# EAGLE design pwm-logger (EAGLE 8.1.1)
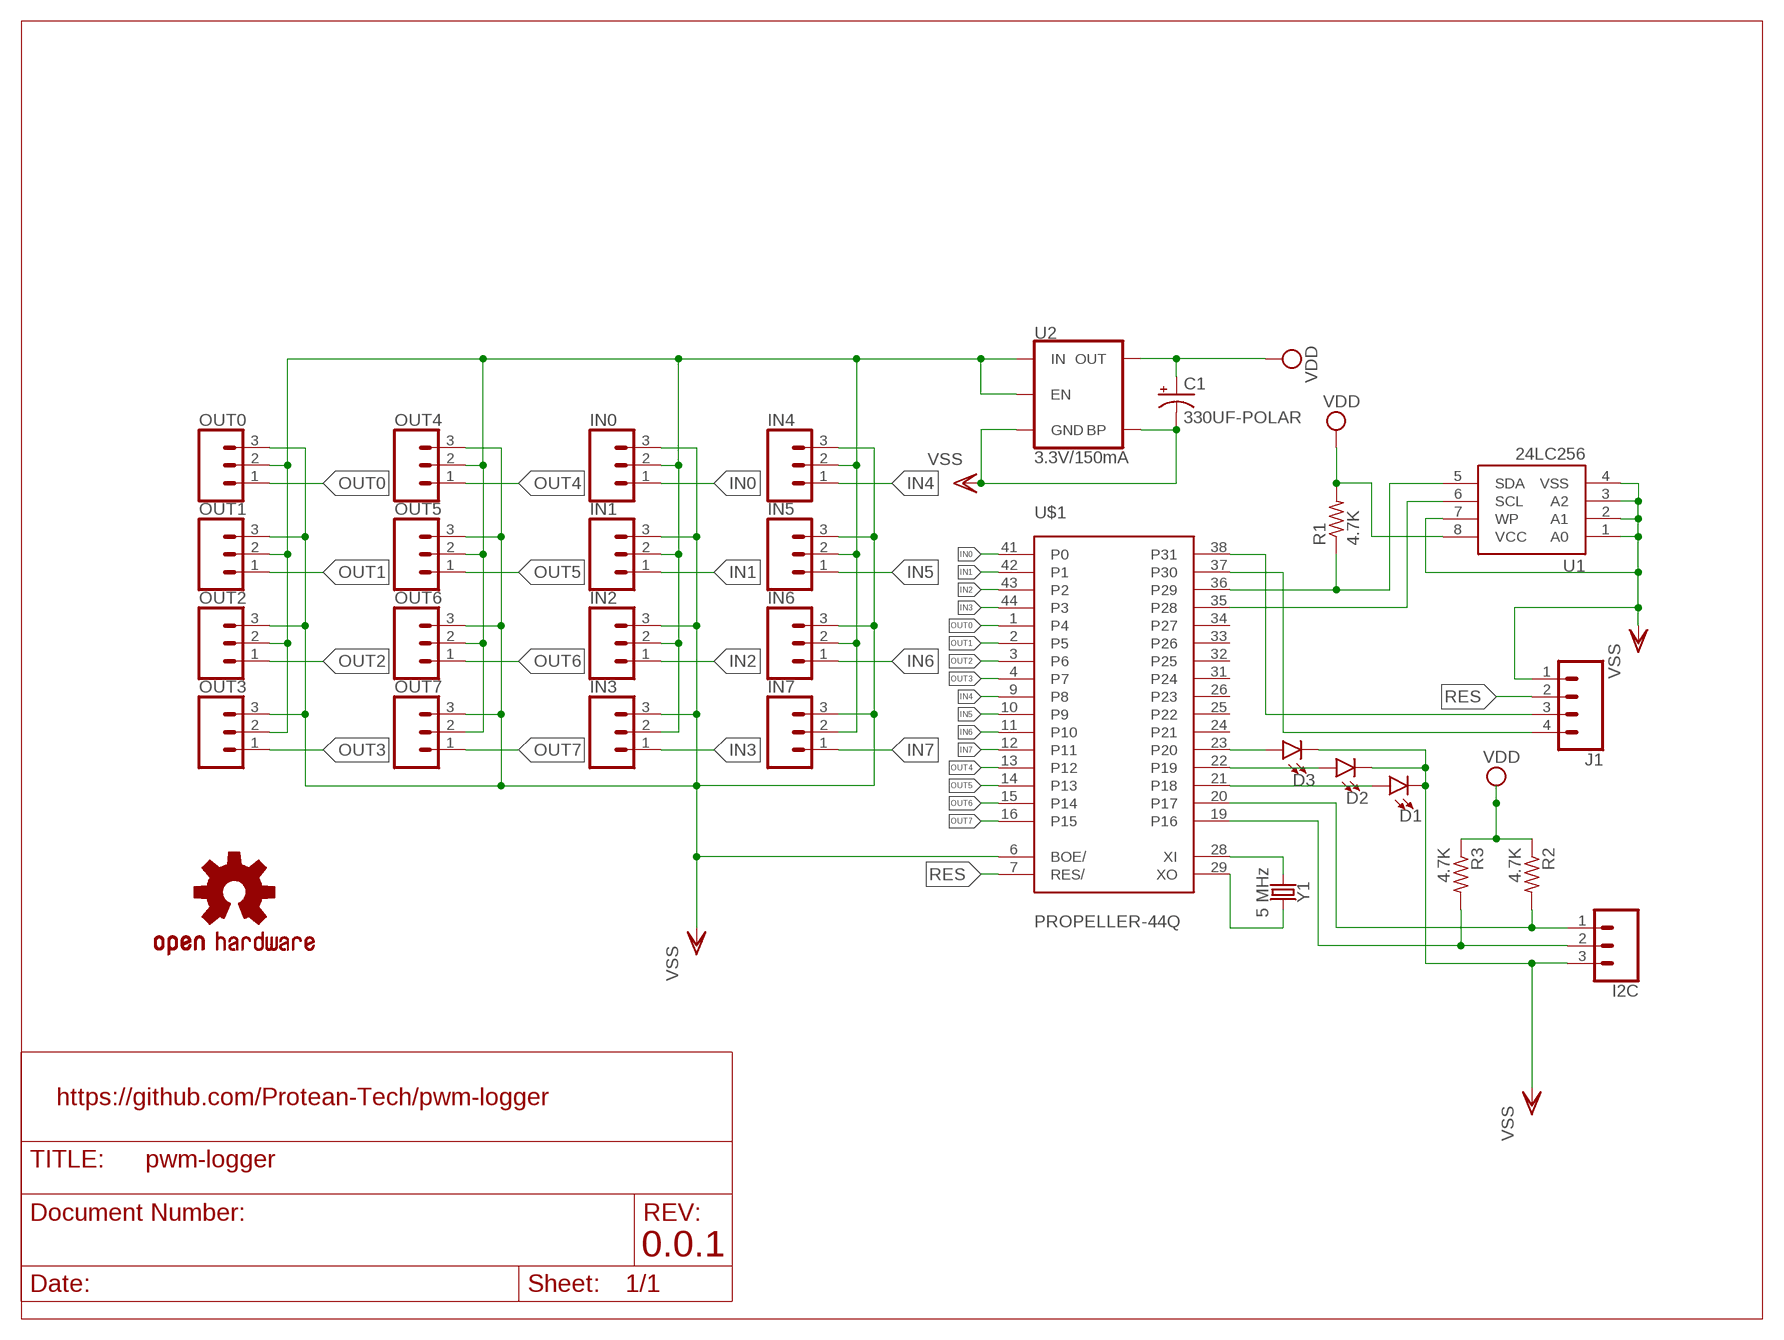
[diagram p0: schematic, sheet 1]

## Parts
C1  330UF-POLAR  [1311]
D1  LED-FKIT-1206  [FKIT-LED-1206]
D2  LED-FKIT-1206  [FKIT-LED-1206]
D3  LED-FKIT-1206  [FKIT-LED-1206]
I2C  CONN_03  [1X03]
IN0  CONN_03  [1X03]
IN1  CONN_03  [1X03]
IN2  CONN_03  [1X03]
IN3  CONN_03  [1X03]
IN4  CONN_03  [1X03]
IN5  CONN_03  [1X03]
IN6  CONN_03  [1X03]
IN7  CONN_03  [1X03]
J1  CONN_04  [1X04]
LOGO1  OSHW-LOGOM  [OSHW-LOGO-M]
OUT0  CONN_03  [1X03]
OUT1  CONN_03  [1X03]
OUT2  CONN_03  [1X03]
OUT3  CONN_03  [1X03]
OUT4  CONN_03  [1X03]
OUT5  CONN_03  [1X03]
OUT6  CONN_03  [1X03]
OUT7  CONN_03  [1X03]
R1  4.7K  R-US_M2012  [M2012]
R2  4.7K  R-US_M2012  [M2012]
R3  4.7K  R-US_M2012  [M2012]
U1  24LC256  EEPROM-I2CSMD  [SO08]
U2  3.3V/150mA  V_REG_MIC52053.3V  [SOT23-5]
U$1  PROPELLER-44Q  [Q44]
Y1  5 MHz  CRYSTALPTH-HC49UV  [HC49U]

## Nets
IN0: IN0.1 U$1.41(P0)
IN1: IN1.1 U$1.42(P1)
IN2: IN2.1 U$1.43(P2)
IN3: IN3.1 U$1.44(P3)
IN4: IN4.1 U$1.9(P8)
IN5: IN5.1 U$1.10(P9)
IN6: IN6.1 U$1.11(P10)
IN7: IN7.1 U$1.12(P11)
N$1: U$1.28(XI) Y1.1
N$2: U$1.29(XO) Y1.2
N$3: D3.A U$1.23(P20)
N$4: D2.A U$1.22(P19)
N$5: J1.3 U$1.38(P31)
N$6: D1.A U$1.21(P18)
N$8: J1.4 U$1.37(P30)
OUT0: OUT0.1 U$1.1(P4)
OUT1: OUT1.1 U$1.2(P5)
OUT2: OUT2.1 U$1.3(P6)
OUT3: OUT3.1 U$1.4(P7)
OUT4: OUT4.1 U$1.13(P12)
OUT5: OUT5.1 U$1.14(P13)
OUT6: OUT6.1 U$1.15(P14)
OUT7: OUT7.1 U$1.16(P15)
POWER_IN: IN0.2 IN1.2 IN2.2 IN3.2 IN4.2 IN5.2 IN6.2 IN7.2 OUT0.2 OUT1.2 OUT2.2 OUT3.2 OUT4.2 OUT5.2 OUT6.2 OUT7.2 U2.1(IN) U2.3(EN)
RES: J1.2 U$1.7(RES/)
SCL: I2C.1 R2.2 U$1.20(P17)
SCL_EEP: U1.6(SCL) U$1.35(P28)
SDA: I2C.2 R3.2 U$1.19(P16)
SDA_EEP: R1.1 U1.5(SDA) U$1.36(P29)
VDD: C1.+ R1.2 R2.1 R3.1 U1.8(VCC) U2.5(OUT)
VSS: C1.- D1.C D2.C D3.C I2C.3 IN0.3 IN1.3 IN2.3 IN3.3 IN4.3 IN5.3 IN6.3 IN7.3 J1.1 OUT0.3 OUT1.3 OUT2.3 OUT3.3 OUT4.3 OUT5.3 OUT6.3 OUT7.3 U1.1(A0) U1.2(A1) U1.3(A2) U1.4(VSS) U1.7(WP) U2.2(GND) U2.4(BP) U$1.6(BOE/)
Unconnected: U$1.24(P21) U$1.25(P22) U$1.26(P23) U$1.31(P24) U$1.32(P25) U$1.33(P26) U$1.34(P27)

## Notes on the sheet
- https://github.com/Protean-Tech/pwm-logger
- 0.0.1

## Power pins joined to a net without a drawn wire
VDD: U$1.8(VDD) U$1.18(VDD) U$1.30(VDD) U$1.40(VDD)
VSS: U$1.5(VSS) U$1.17(VSS) U$1.27(VSS) U$1.39(VSS)

## Library data of the parts
C1 = SparkFun-Capacitors:330UF-POLAR: 330µF polarized capacitors A capacitor is a passive two-terminal electrical component used to store electrical energy temporarily in an electric field.
D1-D3 = SparkFun-LED:LED: LED (Generic) Standard schematic elements and footprints for 5mm, 3mm, 1206, and 0603 sized LEDs. Generic LEDs with no color specified.
I2C IN0 IN1-IN7 OUT0 OUT1-OUT7 = SparkFun-Connectors:CONN_03: Multi connection point. Often used as Generic Header-pin footprint for 0.1 inch spaced/style header connections On any of the 0.1 inch spaced packages, you can populate with these: Break Away Headers - Straight <https://www.sparkfun.com/products/116> (PRT-00116) Break Away Male Headers - Right Angle <https://www.sparkfun.com/products/553> (PRT-00553) Female Headers <https://www.sparkfun.com/products/115> (PRT-00115) Break Away Headers - Machine Pin <https://www.sparkfun.com/products/117> (PRT-00117) Break Away Female Headers - Swiss Machine Pin <https://www.sparkfun.com/products/743> (PRT-00743) Stackable Header - 3 Pin (Female, 0.1") <https://www.sparkfun.com/products/13875> (PRT-13875) For SCREWTERMINALS and SPRING TERMINALS visit here: Screw Terimnals on SparkFun.com <https://www.sparkfun.com/search/results?term=Screw+Terminals> (5mm/3.5mm/2.54mm spacing) This device is also useful as a general connection point to wire up your design to another part of your project. Our various solder wires solder well into these plated through hole pads. Hook-Up Wire - Assortment (Stranded, 22 AWG) <https://www.sparkfun.com/products/11375> (PRT-11375) Hook-Up Wire - Assortment (Solid Core, 22 AWG) <https://www.sparkfun.com/products/11367> (PRT-11367) View the entire wire category on our website here <https://www.sparkfun.com/categories/141> Special notes: Molex polarized connector foot print use with SKU : PRT-08232 with associated crimp pins and housings.
J1 = SparkFun-Connectors:CONN_04: Multi connection point. Often used as Generic Header-pin footprint for 0.1 inch spaced/style header connections On any of the 0.1 inch spaced packages, you can populate with these: Break Away Headers - Straight <https://www.sparkfun.com/products/116> (PRT-00116) Break Away Male Headers - Right Angle <https://www.sparkfun.com/products/553> (PRT-00553) Female Headers <https://www.sparkfun.com/products/115> (PRT-00115) Break Away Headers - Machine Pin <https://www.sparkfun.com/products/117> (PRT-00117) Break Away Female Headers - Swiss Machine Pin <https://www.sparkfun.com/products/743> (PRT-00743) For SCREWTERMINALS and SPRING TERMINALS visit here: Screw Terimnals on SparkFun.com <https://www.sparkfun.com/search/results?term=Screw+Terminals> (5mm/3.5mm/2.54mm spacing) This device is also useful as a general connection point to wire up your design to another part of your project. Our various solder wires solder well into these plated through hole pads. Hook-Up Wire - Assortment (Stranded, 22 AWG) <https://www.sparkfun.com/products/11375> (PRT-11375) Hook-Up Wire - Assortment (Solid Core, 22 AWG) <https://www.sparkfun.com/products/11367> (PRT-11367) View the entire wire category on our website here <https://www.sparkfun.com/categories/141> Special notes: Molex polarized connector foot print use with SKU : PRT-08231 with associated crimp pins and housings. 1MM SMD Version SKU: PRT-10208; PROD_ID: CONN-09696
LOGO1 = SparkFun-Aesthetics:OSHW-LOGO: Open-Source Hardware (OSHW) Logo This logo indicates the piece of hardware it is found on incorporates a OSHW license and/or adheres to the definition of open source hardware found here: http://freedomdefined.org/OSHW
R1-R3 = resistor:R-US_: RESISTOR, American symbol
U1 = SparkFun-IC-Memory:EEPROM-I2C: I2C EEPROMs, 24LC256 and others 24LC256 Series 256 kb I2C 2 Wire (32 k x 8 Bit) 2.5 V Serial EEPROM SMD - SOIC-8 Datasheet SparkFun Products SparkFun UDB5 - PIC UAV Development Board <https://www.sparkfun.com/products/11703> (GPS-11703); PROD_ID: IC-09714
U2 = SparkFun-IC-Power:V_REG_MIC5205: V_REG MIC5205 Standard 3.3V, 5V, and Adjustable 150mA LDO voltage regulator in SOT-23 layout. Micrel part MIC5205. BP (by-pass) pin is used to lower output noise with 470pF cap, may be left open. On the adjustable version BP is used to set output.; PROD_ID: VREG-00822
U$1 = parallax:PROPELLER-44
Y1 = SparkFun-Clocks:CRYSTAL: Crystals (Generic) These are passive quartz crystals, which can be used as a clock source for a microcontroller. Crystal's are two-terminal devices. They require external "load" capacitors to generate an oscillating signal.

## Board
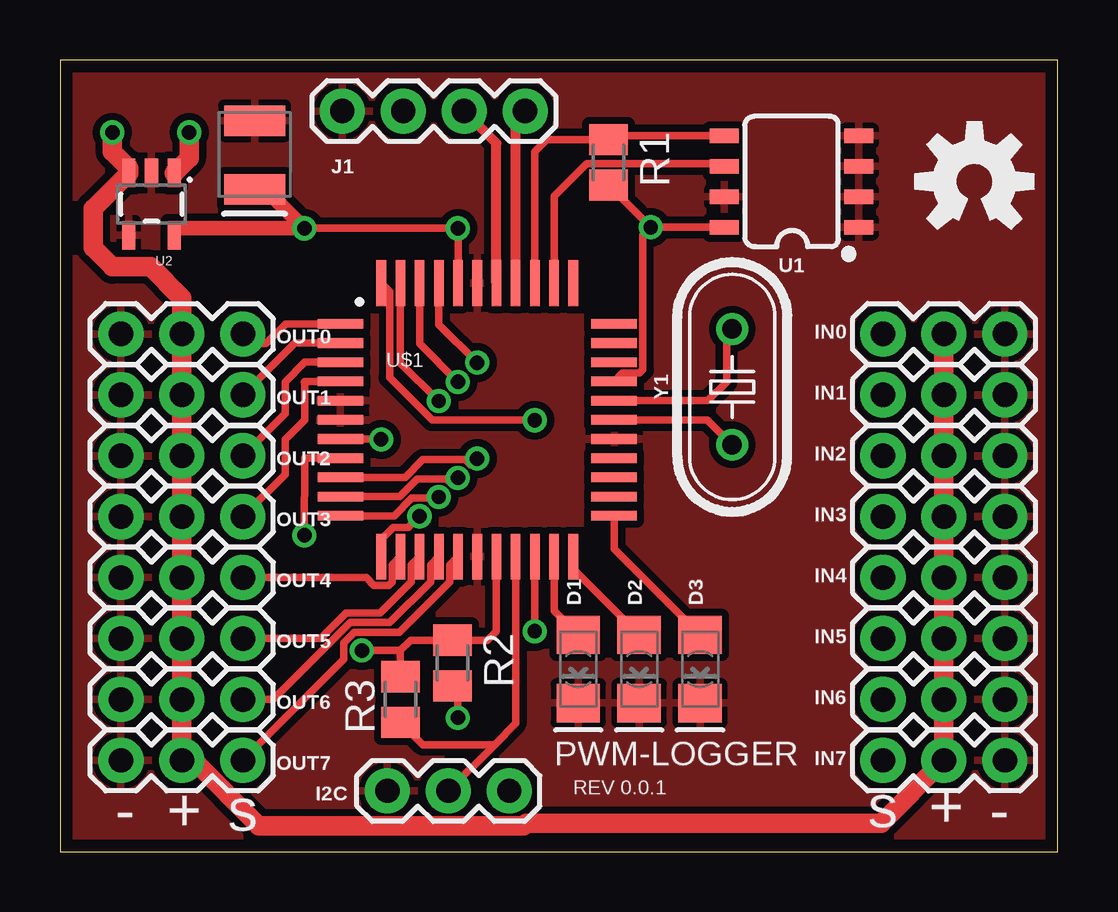
[diagram p1: board, top side]
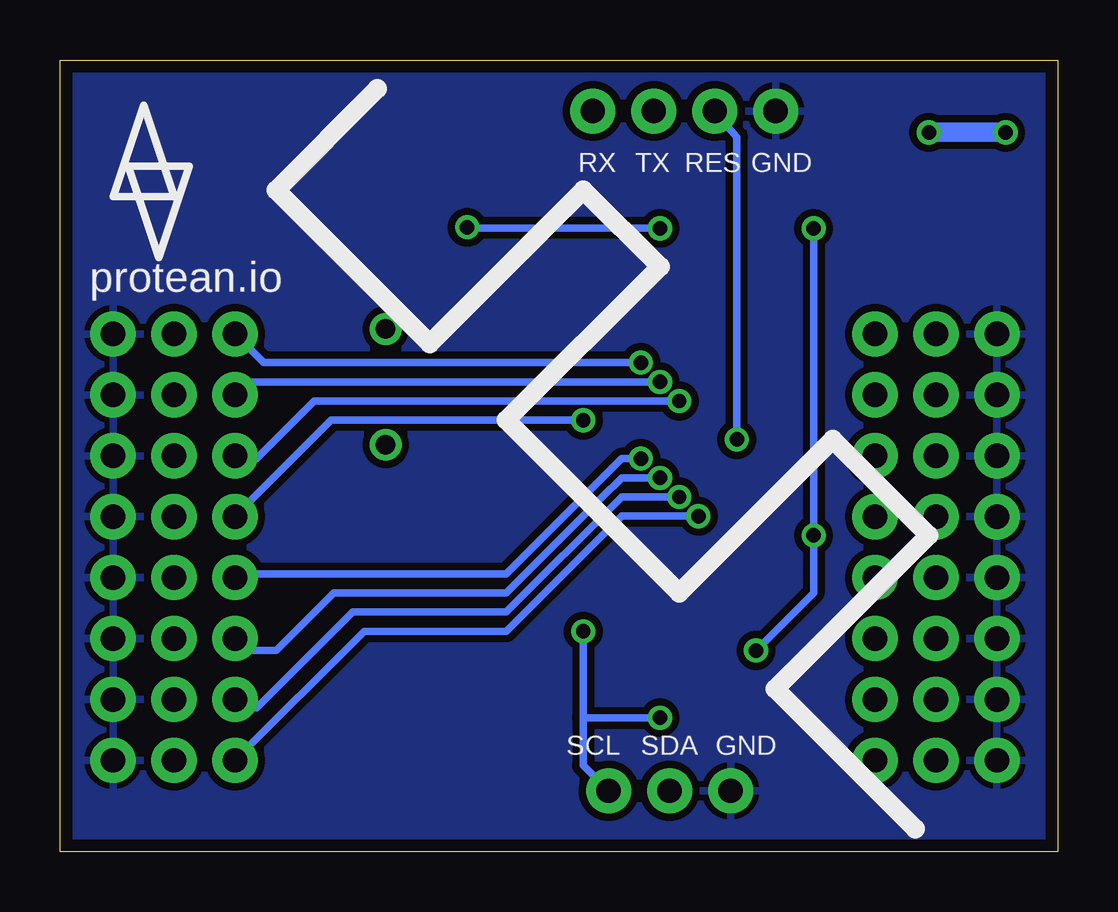
[diagram p2: board, bottom side, seen from below]

Size 41.58 x 33.01 mm. Coordinates in mm from the lower left corner, seen from the top.
Outline: 0,0 41.58,0 41.58,33.01 0,33.01 0,0
Copper layers (1*16): Top 0.035mm / dielectric 1.5mm / Bottom 0.035mm
Design rules "default *": minimum track width 10mil, minimum drill 24mil, track to track 4mil, track to pad 4mil, pad to pad 4mil, via to via 4mil, smd to smd 4mil, copper to edge 20mil, drill to drill 8mil, minimum pad ring 10mil, minimum via ring 8mil, stop-mask expansion 4mil, vias tented up to drill 0mil, thermal gap 10mil

### Footprints (pad centres in the part's own frame; a part is rotated, then mirrored left to right if it is on the bottom)
1311 = smd 1.27 x 2.54: + 3.175,-1.27; - 0.318,-1.27
FKIT-LED-1206 = smd 1.6 x 1.803: A -1.422,0; C 1.422,0
1X03 = drill 1.016 pad 1.88: 1 0,0; 2 2.54,0; 3 5.08,0
1X04 = drill 1.016 pad 1.88: 1 0,0; 2 2.54,0; 3 5.08,0; 4 7.62,0
M2012 = smd 1.3 x 1.6: 1 -0.95,0; 2 0.95,0
SO08 = smd 0.6 x 1.2: 1 -1.905,-2.8; 2 -0.635,-2.8; 3 0.635,-2.8; 4 1.905,-2.8; 5 1.905,2.8; 6 0.635,2.8; 7 -0.635,2.8; 8 -1.905,2.8
SOT23-5 = smd 0.55 x 1.2: 1 -0.95,-1.3; 2 0,-1.3; 3 0.95,-1.3; 4 0.95,1.3; 5 -0.95,1.3
Q44 = smd 1.9 x 0.4: 1 -5.713,4.013; 2 -5.713,3.212; 3 -5.713,2.413; 4 -5.713,1.613; 5 -5.713,0.812; 6 -5.713,0.013; 7 -5.713,-0.787; 8 -5.713,-1.587; 9 -5.713,-2.388; 10 -5.713,-3.188; 11 -5.713,-3.987; 23 5.688,-3.987; 24 5.688,-3.188; 25 5.688,-2.388; 26 5.688,-1.587; 27 5.688,-0.787; 28 5.688,0.013; 29 5.688,0.812; 30 5.688,1.613; 31 5.688,2.413; 32 5.688,3.212; 33 5.688,4.013 | smd 0.4 x 1.9: 12 -4.013,-5.688; 13 -3.212,-5.688; 14 -2.413,-5.688; 15 -1.613,-5.688; 16 -0.812,-5.688; 17 -0.013,-5.688; 18 0.787,-5.688; 19 1.587,-5.688; 20 2.388,-5.688; 21 3.188,-5.688; 22 3.987,-5.688; 34 3.987,5.713; 35 3.188,5.713; 36 2.388,5.713; 37 1.587,5.713; 38 0.787,5.713; 39 -0.013,5.713; 40 -0.812,5.713; 41 -1.613,5.713; 42 -2.413,5.713; 43 -3.212,5.713; 44 -4.013,5.713
HC49U = drill 0.813: 1 -2.413,0; 2 2.413,0

### Placement (x,y rotation side)
C1  9.38,30.79 270 top
D1  21.59,7.62 270 top
D2  24.13,7.62 270 top
D3  26.67,7.62 270 top
I2C  18.72,2.54 180 top
IN0  34.29,21.59 0 top
IN1  34.29,19.05 0 top
IN2  34.29,16.51 0 top
IN3  34.29,13.97 0 top
IN4  34.29,11.43 0 top
IN5  34.29,8.89 0 top
IN6  34.29,6.35 0 top
IN7  34.29,3.81 0 top
J1  11.76,30.88 0 top
LOGO1  38.1,27.94 0 top
OUT0  7.62,21.59 180 top
OUT1  7.62,19.05 180 top
OUT2  7.62,16.51 180 top
OUT3  7.62,13.97 180 top
OUT4  7.62,11.43 180 top
OUT5  7.62,8.89 180 top
OUT6  7.62,6.35 180 top
OUT7  7.62,3.81 180 top
R1  22.86,28.74 270 top
R2  16.36,7.87 270 top
R3  14.18,6.35 270 top
U1  30.48,27.94 90 top
U2  3.81,27 180 top
U$1  17.4,18 0 top
Y1  28.01,19.38 90 top

### Tracks (layer width: path | path; a pad name or v marks a point on that pad's centre or on a via)
IN0  (via drill 0.6)
  Top 0.305: U$1.41 15.79,21.98 v17.38,20.39
  Bottom 0.305: v17.38,20.39 33.09,20.39 IN0.1
IN1  (via drill 0.6)
  Top 0.305: U$1.42 14.99,21.18 v16.58,19.59
  Bottom 0.305: v16.58,19.59 33.75,19.59 IN1.1
IN2  (via drill 0.6)
  Top 0.305: U$1.43 14.19,20.38 v15.78,18.79
  Bottom 0.305: v15.78,18.79 30.98,18.79 33.38,16.39 34.17,16.39 IN2.1
IN3  (via drill 0.6)
  Top 0.305: U$1.44 13.73,23.36 13.73,19.77 15.51,17.99 v19.78,17.99
  Bottom 0.305: v19.78,17.99 30.27,17.99 IN3.1
IN4  (via drill 0.6)
  Top 0.305: U$1.9 14.38,15.61 15.12,16.35 16.89,16.35 17.11,16.12 v17.38,16.39
  Bottom 0.305: v17.38,16.39 18.18,16.39 22.98,11.59 34.13,11.59 IN4.1
IN5  (via drill 0.6)
  Top 0.305: U$1.10 14.15,14.81 14.89,15.55 16.09,15.55 16.31,15.32 v16.58,15.59
  Bottom 0.305: v16.58,15.59 18.18,15.59 18.98,14.79 22.98,10.79 30.18,10.79 32.58,8.39 33.79,8.39 IN5.1
IN6  (via drill 0.6)
  Top 0.305: U$1.11 13.93,14.01 14.67,14.75 15.74,14.75 v15.78,14.79
  Bottom 0.305: v15.78,14.79 18.18,14.79 22.98,9.99 29.38,9.99 33.38,5.99 33.93,5.99 IN6.1
IN7  (via drill 0.6)
  Top 0.305: v14.98,13.99 14.5,13.51 13.88,13.51 13.39,13.02 U$1.12
  Bottom 0.305: v14.98,13.99 18.18,13.99 22.98,9.19 28.91,9.19 IN7.1
N$1
  Top 0.305: U$1.28 26.97,18.01 Y1.1
N$2
  Top 0.305: U$1.29 27,18.81 27.78,19.59 27.78,21.56 Y1.2
N$3
  Top 0.305: U$1.23 23.09,12.63 D3.A
N$4
  Top 0.305: U$1.22 21.39,11.78 D2.A
N$5
  Top 0.406: U$1.38 18.19,29.53 J1.3
N$6
  Top 0.305: U$1.21 20.59,10.05 D1.A
N$8
  Top 0.406: U$1.37 18.99,30.49 J1.4
OUT0
  Top 0.305: U$1.1 9.4,22.01 8.58,21.19 8.02,21.19 OUT0.1
OUT1
  Top 0.305: U$1.2 9.78,21.21 OUT1.1
OUT2
  Top 0.305: U$1.3 10.2,20.41 9.38,19.59 9.38,18.27 OUT2.1
OUT3
  Top 0.305: U$1.4 10.2,19.61 | 10.2,19.61 10.18,19.59 | 10.2,19.61 10.2,18.01 9.38,17.19 9.38,15.73 OUT3.1
OUT4
  Top 0.305: U$1.13 13.84,11.96 13.84,11.25 13.69,11.1 13.08,11.1 12.76,11.43 OUT4.1
OUT5
  Top 0.305: U$1.14 14.64,11.96 14.64,11.25 13.35,9.96 11.93,9.96 10.86,8.89 OUT5.1
OUT6
  Top 0.305: U$1.15 15.44,11.96 15.44,11.25 13.74,9.55 12.1,9.55 8.89,6.35 OUT6.1
OUT7
  Top 0.305: U$1.16 16.24,11.96 16.24,11.25 14.13,9.15 12.27,9.15 11.82,8.7 11.82,8.01 OUT7.1
POWER_IN  (via drill 0.6)
  Top 0.305: 2.06,29.87 v2.18,29.99
  Top 0.813: v5.38,29.99 5.38,28.92 U2.1 | IN0.2 IN1.2 IN2.2 IN3.2 IN4.2 IN5.2 IN6.2 IN7.2 34.21,1.19 19.42,1.19 19.32,1.09 8.29,1.09 5.57,3.81 OUT7.2 OUT6.2 OUT5.2 OUT4.2 OUT3.2 OUT2.2 OUT1.2 OUT0.2 5.08,23.09 3.78,24.39 2.18,24.39 1.38,25.19 1.38,26.82 U2.3 2.86,28.51 2.18,29.19 v2.18,29.99
  Bottom 0.813: v2.18,29.99 v5.38,29.99
RES  (via drill 0.6)
  Top 0.305: U$1.7 13.36,17.21 v13.38,17.19
  Bottom 0.305: v13.38,17.19 13.38,29.8 J1.2
SCL  (via drill 0.6)
  Top 0.305: U$1.20 v19.78,9.19 | v16.58,5.59 16.58,6.7 R2.2
  Bottom 0.305: v19.78,9.19 19.78,5.59 | 19.78,5.59 19.78,3.6 I2C.1 | 19.78,5.59 v16.58,5.59
SCL_EEP
  Top 0.305: U$1.35 20.59,27.33 21.95,28.69 27.56,28.69 U1.6
SDA
  Top 0.305: U$1.19 18.99,5.35 18.1,4.46 | 18.1,4.46 I2C.2 | 18.1,4.46 15.11,4.46 R3.2
SDA_EEP
  Top 0.305: U1.5 23.01,29.84 R1.1 20.28,29.69 19.78,29.19 U$1.36
VDD  (via drill 0.6)
  Top 0.305: v24.61,26.03 U1.8 | v24.61,26.03 R1.2 | U$1.30 23.43,19.95 24.14,19.95 24.29,20.1 24.29,25.71 v24.61,26.03 | U$1.40 v16.59,25.98 v16.58,25.98 v16.58,25.99 v10.18,25.99 | 5.05,25.99 U2.5 | 14.18,8.39 14.61,8.82 R2.1 17.81,8.82 18.18,9.19 U$1.18 | 14.18,8.39 R3.1 | R3.1 | v10.18,13.19 10.2,16.41 U$1.8 | v12.58,8.39 14.18,8.39
  Top 0.61: 5.05,25.99 v10.18,25.99 8.55,27.62 C1.+
  Bottom 0.305: v16.58,25.99 24.57,25.99 24.61,25.99 v24.61,26.03 | v10.18,25.99 v10.18,13.19 10.18,10.79 v12.58,8.39
VSS
  pour Bottom (isolate 0.305): 41.91,0 41.91,33.02 0,33.02 0,0
  pour Top (isolate 0.305): 0,33.02 0,0 41.91,0 41.91,33.02

### Text on the board
tNames: PWM-LOGGER | REV 0.0.1 | - | + | s | s | + | -
bNames: GND | RES | TX | RX | protean.io | GND | SDA | SCL